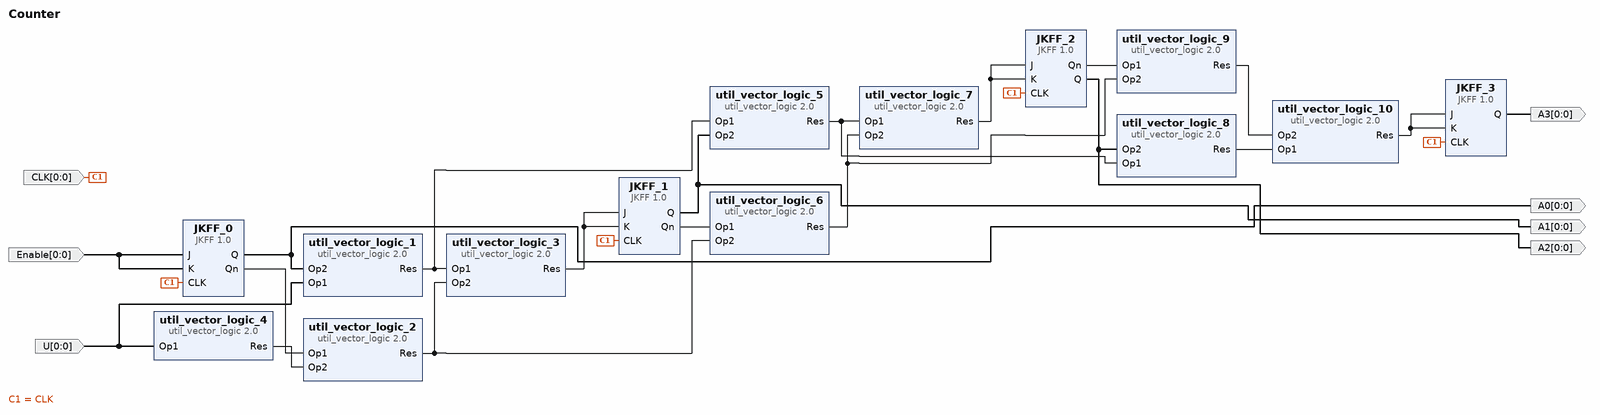
[diagram p0: block diagram of the top level]
# Vivado block design Counter, xc7vx485tffg1157-1, Vivado 2019.1
create_bd_design Counter

create_bd_port -dir O -from 0 -to 0 A3
create_bd_port -dir O -from 0 -to 0 A2
create_bd_port -dir O -from 0 -to 0 A1
create_bd_port -dir O -from 0 -to 0 A0
create_bd_port -dir I -from 0 -to 0 U
create_bd_port -dir I -from 0 -to 0 Enable
create_bd_port -dir I -from 0 -to 0 CLK

create_bd_cell -type ip -vlnv xilinx.com:ip:util_vector_logic:2.0 util_vector_logic_1
set_property -dict {CONFIG.C_SIZE 1} [get_bd_cells util_vector_logic_1]
create_bd_cell -type ip -vlnv Group5:user:JKFF:1.0 JKFF_0
create_bd_cell -type ip -vlnv xilinx.com:ip:util_vector_logic:2.0 util_vector_logic_2
set_property -dict {CONFIG.C_SIZE 1} [get_bd_cells util_vector_logic_2]
create_bd_cell -type ip -vlnv xilinx.com:ip:util_vector_logic:2.0 util_vector_logic_3
set_property -dict {CONFIG.C_OPERATION or CONFIG.C_SIZE 1} [get_bd_cells util_vector_logic_3]
create_bd_cell -type ip -vlnv xilinx.com:ip:util_vector_logic:2.0 util_vector_logic_4
set_property -dict {CONFIG.C_OPERATION not CONFIG.C_SIZE 1} [get_bd_cells util_vector_logic_4]
create_bd_cell -type ip -vlnv Group5:user:JKFF:1.0 JKFF_1
create_bd_cell -type ip -vlnv xilinx.com:ip:util_vector_logic:2.0 util_vector_logic_5
set_property -dict {CONFIG.C_SIZE 1} [get_bd_cells util_vector_logic_5]
create_bd_cell -type ip -vlnv xilinx.com:ip:util_vector_logic:2.0 util_vector_logic_6
set_property -dict {CONFIG.C_SIZE 1} [get_bd_cells util_vector_logic_6]
create_bd_cell -type ip -vlnv xilinx.com:ip:util_vector_logic:2.0 util_vector_logic_7
set_property -dict {CONFIG.C_OPERATION or CONFIG.C_SIZE 1} [get_bd_cells util_vector_logic_7]
create_bd_cell -type ip -vlnv Group5:user:JKFF:1.0 JKFF_2
create_bd_cell -type ip -vlnv xilinx.com:ip:util_vector_logic:2.0 util_vector_logic_8
set_property -dict {CONFIG.C_SIZE 1} [get_bd_cells util_vector_logic_8]
create_bd_cell -type ip -vlnv xilinx.com:ip:util_vector_logic:2.0 util_vector_logic_9
set_property -dict {CONFIG.C_SIZE 1} [get_bd_cells util_vector_logic_9]
create_bd_cell -type ip -vlnv xilinx.com:ip:util_vector_logic:2.0 util_vector_logic_10
set_property -dict {CONFIG.C_OPERATION or CONFIG.C_SIZE 1} [get_bd_cells util_vector_logic_10]
create_bd_cell -type ip -vlnv Group5:user:JKFF:1.0 JKFF_3

# ---- connections ----

connect_bd_net [get_bd_pins JKFF_0/Q] [get_bd_pins util_vector_logic_1/Op2] [get_bd_ports A0]
connect_bd_net [get_bd_pins JKFF_0/Qn] [get_bd_pins util_vector_logic_2/Op1]
connect_bd_net [get_bd_ports U] [get_bd_pins util_vector_logic_1/Op1] [get_bd_pins util_vector_logic_4/Op1]
connect_bd_net [get_bd_pins util_vector_logic_1/Res] [get_bd_pins util_vector_logic_3/Op1] [get_bd_pins util_vector_logic_5/Op1]
connect_bd_net [get_bd_pins util_vector_logic_2/Res] [get_bd_pins util_vector_logic_3/Op2] [get_bd_pins util_vector_logic_6/Op2]
connect_bd_net [get_bd_ports CLK] [get_bd_pins JKFF_0/CLK] [get_bd_pins JKFF_1/CLK] [get_bd_pins JKFF_2/CLK] [get_bd_pins JKFF_3/CLK]
connect_bd_net -net xlconstant_0_dout [get_bd_ports Enable] [get_bd_pins JKFF_0/J] [get_bd_pins JKFF_0/K]
connect_bd_net [get_bd_pins util_vector_logic_4/Res] [get_bd_pins util_vector_logic_2/Op2]
connect_bd_net -net JKFF_0_Q1 [get_bd_pins JKFF_1/Q] [get_bd_pins util_vector_logic_5/Op2] [get_bd_ports A1]
connect_bd_net -net JKFF_0_Qn1 [get_bd_pins JKFF_1/Qn] [get_bd_pins util_vector_logic_6/Op1]
connect_bd_net -net util_vector_logic_1_Res1 [get_bd_pins util_vector_logic_5/Res] \
  [get_bd_pins util_vector_logic_7/Op1] [get_bd_pins util_vector_logic_8/Op1]
connect_bd_net -net util_vector_logic_2_Res1 [get_bd_pins util_vector_logic_6/Res] \
  [get_bd_pins util_vector_logic_7/Op2] [get_bd_pins util_vector_logic_9/Op2]
connect_bd_net -net xlconstant_0_dout1 [get_bd_pins util_vector_logic_3/Res] [get_bd_pins JKFF_1/J] [get_bd_pins JKFF_1/K]
connect_bd_net -net JKFF_0_Q2 [get_bd_pins JKFF_2/Q] [get_bd_pins util_vector_logic_8/Op2] [get_bd_ports A2]
connect_bd_net -net JKFF_0_Qn2 [get_bd_pins JKFF_2/Qn] [get_bd_pins util_vector_logic_9/Op1]
connect_bd_net -net util_vector_logic_1_Res3 [get_bd_pins util_vector_logic_8/Res] [get_bd_pins util_vector_logic_10/Op1]
connect_bd_net -net util_vector_logic_2_Res3 [get_bd_pins util_vector_logic_9/Res] [get_bd_pins util_vector_logic_10/Op2]
connect_bd_net -net xlconstant_0_dout2 [get_bd_pins util_vector_logic_7/Res] [get_bd_pins JKFF_2/J] [get_bd_pins JKFF_2/K]
connect_bd_net -net xlconstant_0_dout3 [get_bd_pins util_vector_logic_10/Res] [get_bd_pins JKFF_3/J] [get_bd_pins JKFF_3/K]
connect_bd_net [get_bd_pins JKFF_3/Q] [get_bd_ports A3]

validate_bd_design
save_bd_design
